# Altium schematic sheet OpAmp_Buffer.SchDoc
size 114 x 38 mm
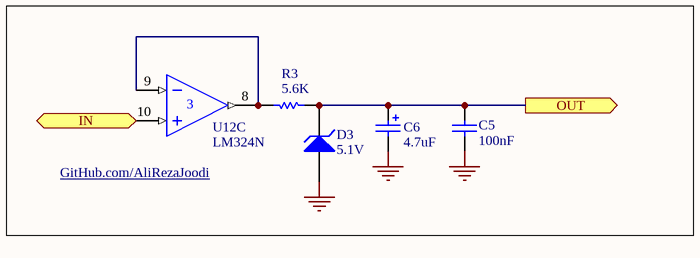
[diagram p0: OpAmp_Buffer.SchDoc]

## Parts
C5  value 100nF  [0805]  (hidden comment: Cap)
C6  value 4.7uF  [Cap_B]  (hidden comment: Capacitor)
D3  value 5.1V  [MELF-D3516-1406]  (hidden comment: D Zener)
R3  value 5.6K  [RESC3216N]  (hidden comment: Res1)
U12  LM324N  [SOP127P636-14N]  (part C of 4)

## Ports
IN (in), OUT (out)

## Nets
GND: C5.2 C6.2 D3.1(A)
IN: U12.10(IN+) ; port IN
OUT: C5.1 C6.1 D3.2(K) R3.1 ; port OUT
NetR3_2: R3.2 U12.8(OUT) U12.9(IN-)

## Notes on the sheet
- (near U12) GitHub.com/AliRezaJoodi

## Library data of the parts
C5 = Cap: Capacitor; Published: 8-Jun-2000; LatestRevisionDate: 17-Jul-2002; LatestRevisionNote: Re-released for DXP Platform.; PackageReference: RAD-0.3; Publisher: Altium Limited
C6 = Cap Pol1: Polarized Capacitor (Radial); Manufacturer: Generic Components; Class I: Passive; Published: 8-Jun-2000; Revision: July-2002: Re-released for DXP Platform.; Publisher: Altium Limited; Class II: Capacitor
D3 = D Zener: Zener Diode; Manufacturer: Generic Components; Class I: Discrete; Class II: Diode - Zener; Published: 8-Jun-2000; Revision: July-2002: Re-released for DXP Platform.; Publisher: Altium Limited
R3 = Res1: Resistor; Published: 8-Jun-2000; LatestRevisionDate: 17-Jul-2002; LatestRevisionNote: Re-released for DXP Platform.; PackageReference: AXIAL-0.3; Publisher: Altium Limited
U12 = LM324N: Quad Low-Power Operational Amplifier; Value: LM324; Published: 17-Jul-2002; LatestRevisionDate: 06-Jun-2005; LatestRevisionNote: Stylized 3D Model Added.; DatasheetVersion: 1988; PackageVersion: 1997; PackageReference: 646-06; Publisher: Altium Limited; PackageDescription: DIP; 14 Leads; Row Spacing 7.62 mm; Pitch 2.54 mm; ComponentLink1Description: Manufacturer Link; ComponentLink1URL: http://www.onsemi.com/site/products/parametrics/0,4446,251,00.html; ComponentLink2Description: Datasheet; ComponentLink2URL: http://www.onsemi.com/pub/Collateral/LM324-D.PDF